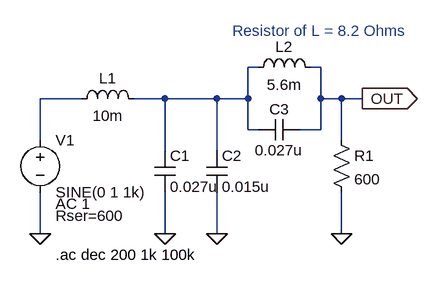
[diagram p0: schematic 2-4_K-M_LPF_Cascade.asc]
2-4_K-M_LPF_Cascade.asc, the LTspice schematic file:
Version 4.1
SHEET 1 880 680
WIRE 432 0 416 0
WIRE 528 0 512 0
WIRE 160 48 96 48
WIRE 288 48 240 48
WIRE 368 48 288 48
WIRE 416 48 416 0
WIRE 416 48 368 48
WIRE 528 48 528 0
WIRE 560 48 528 48
WIRE 592 48 560 48
WIRE 416 96 416 48
WIRE 432 96 416 96
WIRE 528 96 528 48
WIRE 528 96 496 96
WIRE 96 112 96 48
WIRE 560 112 560 48
WIRE 288 128 288 48
WIRE 368 128 368 48
WIRE 96 256 96 192
WIRE 288 256 288 192
WIRE 368 256 368 192
WIRE 560 256 560 192
FLAG 592 48 OUT
IOPIN 592 48 Out
FLAG 96 256 0
FLAG 288 256 0
FLAG 368 256 0
FLAG 560 256 0
SYMBOL voltage 96 96 R0
WINDOW 123 24 114 Left 2
WINDOW 39 24 132 Left 2
SYMATTR Value2 AC 1
SYMATTR SpiceLine Rser=600
SYMATTR InstName V1
SYMATTR Value SINE(0 1 1k)
SYMBOL ind 144 64 R270
WINDOW 0 32 56 VTop 2
WINDOW 3 5 56 VBottom 2
SYMATTR InstName L1
SYMATTR Value 10m
SYMBOL cap 272 128 R0
SYMATTR InstName C1
SYMATTR Value 0.027u
SYMBOL cap 352 128 R0
SYMATTR InstName C2
SYMATTR Value 0.015u
SYMBOL ind 416 16 R270
WINDOW 0 32 56 VTop 2
WINDOW 3 5 56 VBottom 2
SYMATTR InstName L2
SYMATTR Value 5.6m
SYMATTR SpiceLine Rser=8.2
SYMBOL cap 496 80 R90
WINDOW 0 0 32 VBottom 2
WINDOW 3 32 32 VTop 2
SYMATTR InstName C3
SYMATTR Value 0.027u
SYMBOL res 544 96 R0
SYMATTR InstName R1
SYMATTR Value 600
TEXT 120 288 Left 2 !.ac dec 200 1k 100k
TEXT 392 -56 Left 2 ;Resistor of L = 8.2 Ohms

The netlist it stands for:
* 2-4_K-M_LPF_Cascade.asc
V1 N002 0 SINE(0 1 1k) AC 1 Rser=600
L1 N002 N001 10m
C1 N001 0 0.027u
C2 N001 0 0.015u
L2 N001 OUT 5.6m Rser=8.2
C3 OUT N001 0.027u
R1 OUT 0 600
.ac dec 200 1k 100k
* Resistor of L = 8.2 Ohms
.backanno
.end